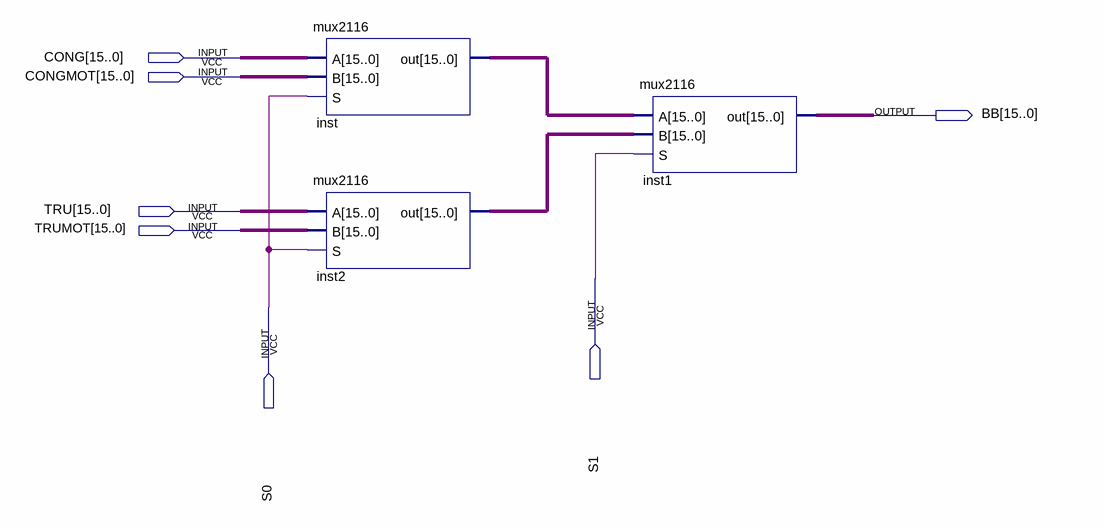
[diagram p0: schematic sheet]
// Quartus schematic mux4116.bdf as structural Verilog: 3 symbols, 7 pins
module mux4116 (
  input  [15:0] CONG,
  input  [15:0] CONGMOT,
  input  [15:0] TRU,
  input  [15:0] TRUMOT,
  input  S1,
  input  S0,
  output [15:0] BB
);

  wire [15:0] inst2_out, inst_out;

  mux2116 inst (.A(CONG), .B(CONGMOT), .S(S0), .out(inst_out));
  mux2116 inst2 (.A(TRU), .B(TRUMOT), .S(S0), .out(inst2_out));
  mux2116 inst1 (.A(inst_out), .B(inst2_out), .S(S1), .out(BB));
endmodule
